# EAGLE schematic onion_dock (EAGLE 7.7.0)
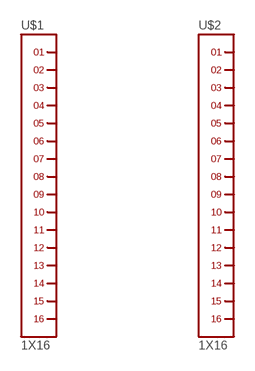
[diagram p0: schematic, sheet 1]

## Parts
U$1  1X16  [1X16]
U$2  1X16  [1X16]
Unconnected: U$1.1 U$1.2 U$1.3 U$1.4 U$1.5 U$1.6 U$1.7 U$1.8 U$1.9 U$1.10 U$1.11 U$1.12 U$1.13 U$1.14 U$1.15 U$1.16 U$2.1 U$2.2 U$2.3 U$2.4 U$2.5 U$2.6 U$2.7 U$2.8 U$2.9 U$2.10 U$2.11 U$2.12 U$2.13 U$2.14 U$2.15 U$2.16

## Library data of the parts
U$1 U$2 = headers(2mm):1X16